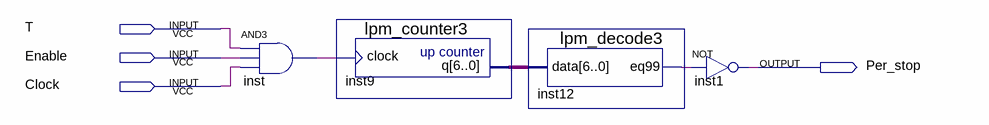
[diagram p0: schematic sheet]
// Quartus schematic count_period.bdf as structural Verilog: 4 symbols, 4 pins
module count_period (
  input  T,
  input  Enable,
  input  Clock,
  output Per_stop
);

  wire inst12_eq99, inst_out;
  wire [6:0] inst9_q;

  and inst (inst_out, T, Enable, Clock);
  lpm_counter3 inst9 (.clock(inst_out), .q(inst9_q));
  lpm_decode3 inst12 (.data(inst9_q), .eq99(inst12_eq99));
  not inst1 (Per_stop, inst12_eq99);
endmodule
